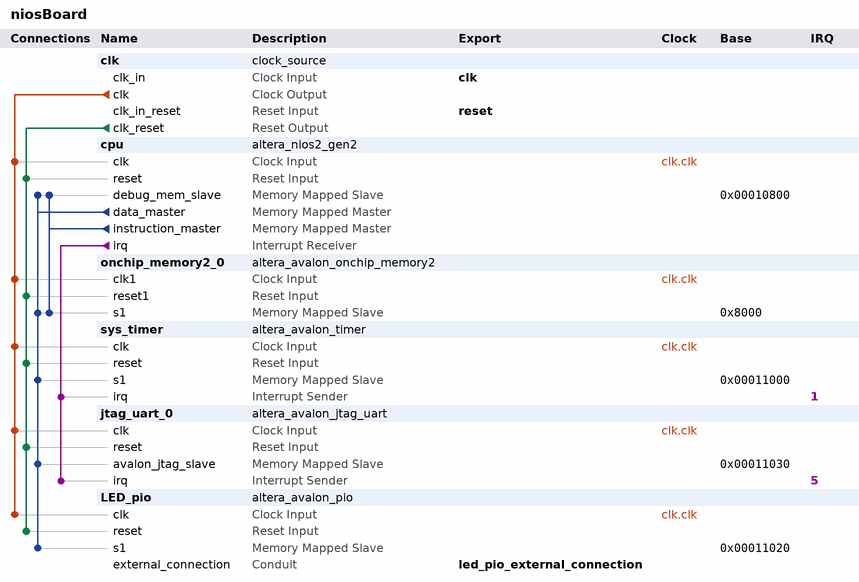
[diagram p0: system contents]
# Platform Designer (Qsys) system niosBoard, Cyclone V 5CSEMA5F31C6
# Parameters at their usual value, and those the tool derives, are not listed.
package require -exact qsys 18.1
create_system niosBoard
set_project_property DEVICE_FAMILY {Cyclone V}
set_project_property DEVICE 5CSEMA5F31C6

add_instance clk clock_source 18.1
set_instance_parameter_value clk clockFrequency 50000000

add_instance cpu altera_nios2_gen2 18.1
set_instance_parameter_value cpu cpuID 1
set_instance_parameter_value cpu dcache_size 2048
set_instance_parameter_value cpu exceptionSlave onchip_memory2_0.s1
set_instance_parameter_value cpu icache_size 4096
set_instance_parameter_value cpu impl Fast
set_instance_parameter_value cpu resetSlave onchip_memory2_0.s1

add_instance onchip_memory2_0 altera_avalon_onchip_memory2 18.1
set_instance_parameter_value onchip_memory2_0 dataWidth 32
set_instance_parameter_value onchip_memory2_0 dualPort false
set_instance_parameter_value onchip_memory2_0 initMemContent true
set_instance_parameter_value onchip_memory2_0 initializationFileName onchip_mem.hex
set_instance_parameter_value onchip_memory2_0 memorySize 20480

add_instance sys_timer altera_avalon_timer 18.1
set_instance_parameter_value sys_timer period 1
set_instance_parameter_value sys_timer periodUnits MSEC

add_instance jtag_uart_0 altera_avalon_jtag_uart 18.1
set_instance_parameter_value jtag_uart_0 simInteractiveOptions NO_INTERACTIVE_WINDOWS

add_instance LED_pio altera_avalon_pio 18.1
set_instance_parameter_value LED_pio direction Output
set_instance_parameter_value LED_pio width 8

# connections
add_connection clk.clk cpu.clk clock
add_connection clk.clk jtag_uart_0.clk clock
add_connection clk.clk LED_pio.clk clock
add_connection clk.clk onchip_memory2_0.clk1 clock
add_connection clk.clk sys_timer.clk clock
add_connection clk.clk_reset cpu.reset reset
add_connection clk.clk_reset jtag_uart_0.reset reset
add_connection clk.clk_reset LED_pio.reset reset
add_connection clk.clk_reset onchip_memory2_0.reset1 reset
add_connection clk.clk_reset sys_timer.reset reset
add_connection cpu.data_master cpu.debug_mem_slave avalon
set_connection_parameter_value cpu.data_master/cpu.debug_mem_slave baseAddress 0x00010800
add_connection cpu.data_master jtag_uart_0.avalon_jtag_slave avalon
set_connection_parameter_value cpu.data_master/jtag_uart_0.avalon_jtag_slave baseAddress 0x00011030
add_connection cpu.data_master LED_pio.s1 avalon
set_connection_parameter_value cpu.data_master/LED_pio.s1 baseAddress 0x00011020
add_connection cpu.data_master onchip_memory2_0.s1 avalon
set_connection_parameter_value cpu.data_master/onchip_memory2_0.s1 baseAddress 0x8000
add_connection cpu.data_master sys_timer.s1 avalon
set_connection_parameter_value cpu.data_master/sys_timer.s1 baseAddress 0x00011000
add_connection cpu.instruction_master cpu.debug_mem_slave avalon
set_connection_parameter_value cpu.instruction_master/cpu.debug_mem_slave baseAddress 0x00010800
add_connection cpu.instruction_master onchip_memory2_0.s1 avalon
set_connection_parameter_value cpu.instruction_master/onchip_memory2_0.s1 baseAddress 0x8000
add_connection cpu.irq jtag_uart_0.irq interrupt
set_connection_parameter_value cpu.irq/jtag_uart_0.irq irqNumber 5
add_connection cpu.irq sys_timer.irq interrupt
set_connection_parameter_value cpu.irq/sys_timer.irq irqNumber 1

# exported interfaces
add_interface clk clock sink
set_interface_property clk EXPORT_OF clk.clk_in
add_interface led_pio_external_connection conduit end
set_interface_property led_pio_external_connection EXPORT_OF LED_pio.external_connection
add_interface reset reset sink
set_interface_property reset EXPORT_OF clk.clk_in_reset

set_interconnect_requirement {$system} qsys_mm.clockCrossingAdapter HANDSHAKE
set_interconnect_requirement {$system} qsys_mm.enableEccProtection FALSE
set_interconnect_requirement {$system} qsys_mm.insertDefaultSlave FALSE
set_interconnect_requirement {$system} qsys_mm.maxAdditionalLatency 1

save_system niosBoard.qsys
